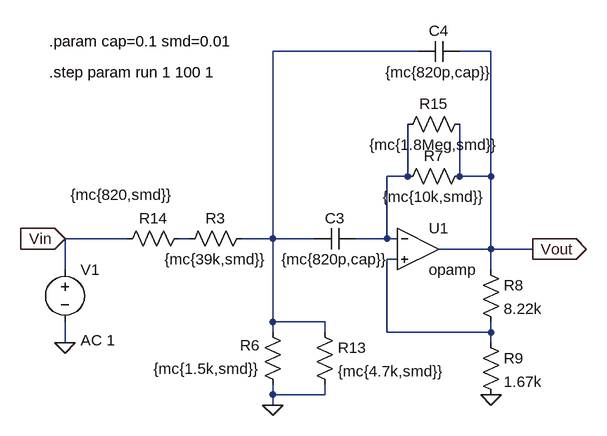
[diagram p0: schematic cell2_build.asc]
cell2_build.asc, the LTspice schematic file:
Version 4
SHEET 1 1440 680
WIRE 1088 -112 864 -112
WIRE 1200 -112 1152 -112
WIRE 1072 80 1072 0
WIRE 1072 80 1040 80
WIRE 1152 80 1152 0
WIRE 1200 80 1200 -112
WIRE 1200 80 1152 80
WIRE 640 176 544 176
WIRE 736 176 720 176
WIRE 864 176 864 -112
WIRE 864 176 816 176
WIRE 928 176 864 176
WIRE 1040 176 1040 80
WIRE 1040 176 992 176
WIRE 1056 176 1040 176
WIRE 1200 192 1200 80
WIRE 1200 192 1120 192
WIRE 1264 192 1200 192
WIRE 1056 208 1040 208
WIRE 544 224 544 176
WIRE 1200 224 1200 192
WIRE 864 304 864 176
WIRE 944 304 864 304
WIRE 864 320 864 304
WIRE 944 320 944 304
WIRE 1040 320 1040 208
WIRE 1200 320 1200 304
WIRE 1200 320 1040 320
WIRE 544 336 544 304
WIRE 1200 336 1200 320
WIRE 864 416 864 400
WIRE 944 416 944 400
WIRE 944 416 864 416
WIRE 864 432 864 416
FLAG 544 336 0
FLAG 544 176 Vin
IOPIN 544 176 In
FLAG 864 432 0
FLAG 1264 192 Vout
IOPIN 1264 192 Out
FLAG 1200 416 0
SYMBOL voltage 544 208 R0
WINDOW 123 24 124 Left 2
WINDOW 39 0 0 Left 0
SYMATTR Value2 AC 1
SYMATTR InstName V1
SYMATTR Value ""
SYMBOL res 832 160 R90
WINDOW 0 0 56 VBottom 2
WINDOW 3 32 56 VTop 2
SYMATTR InstName R3
SYMATTR Value {mc{39k,smd}}
SYMBOL res 880 416 R180
WINDOW 0 36 76 Left 2
WINDOW 3 36 40 Left 2
SYMATTR InstName R6
SYMATTR Value {mc{1.5k,smd}}
SYMBOL res 1168 64 R90
WINDOW 0 0 56 VBottom 2
WINDOW 3 32 56 VTop 2
SYMATTR InstName R7
SYMATTR Value {mc{10k,smd}}
SYMBOL res 1184 208 R0
SYMATTR InstName R8
SYMATTR Value 8.22k
SYMBOL res 1184 320 R0
SYMATTR InstName R9
SYMATTR Value 1.67k
SYMBOL cap 992 160 R90
WINDOW 0 0 32 VBottom 2
WINDOW 3 32 32 VTop 2
SYMATTR InstName C3
SYMATTR Value {mc{820p,cap}}
SYMBOL cap 1152 -128 R90
WINDOW 0 0 32 VBottom 2
WINDOW 3 32 32 VTop 2
SYMATTR InstName C4
SYMATTR Value {mc{820p,cap}}
SYMBOL Opamps\\opamp 1088 128 R0
SYMATTR InstName U1
SYMBOL res 928 304 R0
SYMATTR InstName R13
SYMATTR Value {mc{4.7k,smd}}
SYMBOL res 736 160 R90
WINDOW 0 0 56 VBottom 2
WINDOW 3 -67 104 VTop 2
SYMATTR InstName R14
SYMATTR Value {mc{820,smd}}
SYMBOL res 1168 -16 R90
WINDOW 0 0 56 VBottom 2
WINDOW 3 32 56 VTop 2
SYMATTR InstName R15
SYMATTR Value {mc{1.8Meg,smd}}
TEXT 520 -128 Left 2 !.param cap=0.1 smd=0.01
TEXT 520 -80 Left 2 !.step param run 1 100 1

The netlist it stands for:
* cell2_build.asc
V1 Vin 0 AC 1
R3 N001 N003 {mc{39k,smd}}
R6 0 N001 {mc{1.5k,smd}}
R7 Vout N002 {mc{10k,smd}}
R8 Vout N004 8.22k
R9 N004 0 1.67k
C3 N002 N001 {mc{820p,cap}}
C4 Vout N001 {mc{820p,cap}}
XU1 N002 N004 Vout opamp Aol=100K GBW=10Meg  ; pins invin noninvin out
R13 N001 0 {mc{4.7k,smd}}
R14 N003 Vin {mc{820,smd}}
R15 Vout N002 {mc{1.8Meg,smd}}
.param cap=0.1 smd=0.01
.step param run 1 100 1
.backanno
.end